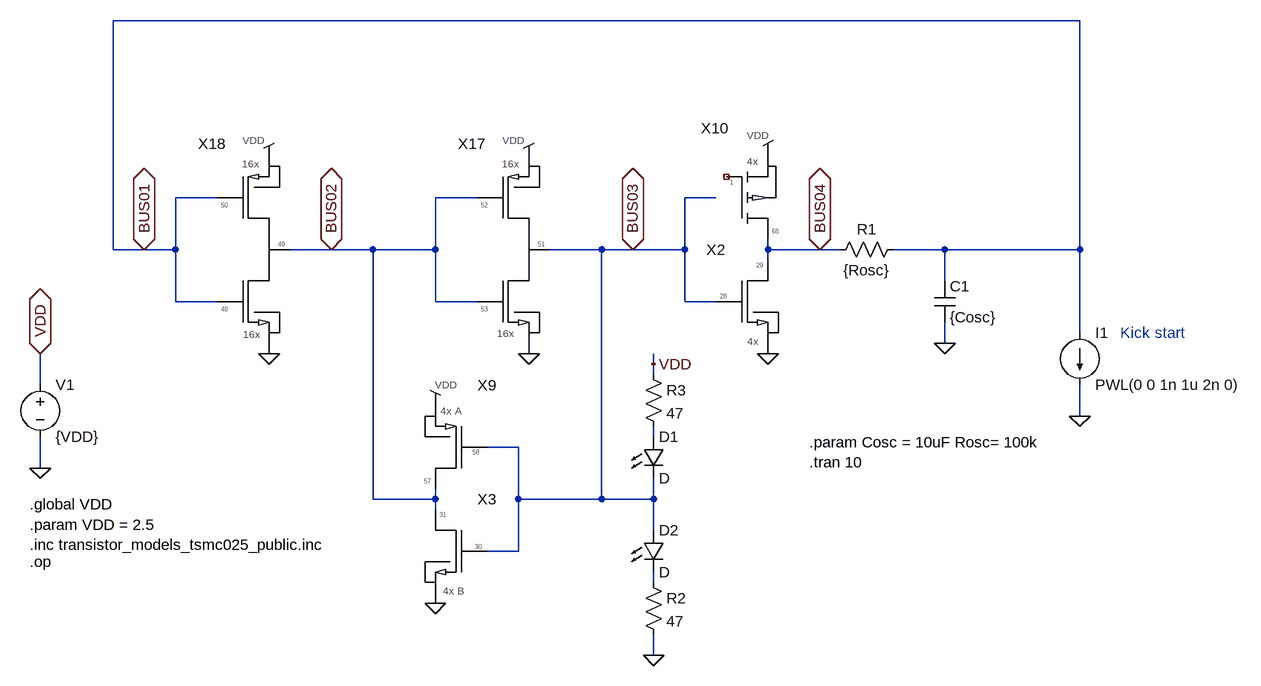
[diagram p0: schematic Example_Schmitt_Trigger_Relaxation_Oscillator.asc]
Example_Schmitt_Trigger_Relaxation_Oscillator.asc, the LTspice schematic file:
Version 4
SHEET 1 4424 996
WIRE 3664 -576 2176 -576
WIRE 2336 -304 2272 -304
WIRE 2736 -304 2672 -304
WIRE 3104 -304 3056 -304
WIRE 2176 -224 2176 -576
WIRE 2224 -224 2176 -224
WIRE 2272 -224 2272 -304
WIRE 2272 -224 2224 -224
WIRE 2512 -224 2448 -224
WIRE 2576 -224 2512 -224
WIRE 2672 -224 2672 -304
WIRE 2672 -224 2576 -224
WIRE 2928 -224 2848 -224
WIRE 2976 -224 2928 -224
WIRE 3056 -224 3056 -304
WIRE 3056 -224 2976 -224
WIRE 3184 -224 3184 -240
WIRE 3264 -224 3184 -224
WIRE 3296 -224 3264 -224
WIRE 3456 -224 3376 -224
WIRE 3664 -224 3664 -576
WIRE 3664 -224 3456 -224
WIRE 3184 -208 3184 -224
WIRE 3456 -176 3456 -224
WIRE 2272 -144 2272 -224
WIRE 2336 -144 2272 -144
WIRE 2672 -144 2672 -224
WIRE 2736 -144 2672 -144
WIRE 3056 -144 3056 -224
WIRE 3104 -144 3056 -144
WIRE 3664 -96 3664 -224
WIRE 3456 -80 3456 -112
WIRE 3008 -48 3008 -64
WIRE 3008 -32 3008 -48
WIRE 2064 -16 2064 -64
WIRE 3664 32 3664 -16
WIRE 3008 64 3008 48
WIRE 2800 80 2752 80
WIRE 2064 112 2064 64
WIRE 2576 160 2576 -224
WIRE 2672 160 2672 144
WIRE 2672 160 2576 160
WIRE 2800 160 2800 80
WIRE 2928 160 2928 -224
WIRE 2928 160 2800 160
WIRE 3008 160 3008 128
WIRE 3008 160 2928 160
WIRE 2672 176 2672 160
WIRE 3008 208 3008 160
WIRE 2800 240 2800 160
WIRE 2800 240 2752 240
WIRE 3008 288 3008 272
WIRE 3008 400 3008 368
FLAG 2224 -224 BUS01
IOPIN 2224 -224 BiDir
FLAG 2512 -224 BUS02
IOPIN 2512 -224 BiDir
FLAG 2976 -224 BUS03
IOPIN 2976 -224 BiDir
FLAG 3264 -224 BUS04
IOPIN 3264 -224 BiDir
FLAG 2064 -64 VDD
IOPIN 2064 -64 BiDir
FLAG 2064 112 0
FLAG 3664 32 0
FLAG 3456 -80 0
FLAG 3008 400 0
FLAG 3008 -48 VDD
SYMBOL CS_nMOS_4x_A 3136 -192 R0
SYMATTR InstName X2
SYMBOL voltage 2064 -32 R0
SYMATTR InstName V1
SYMATTR Value {VDD}
SYMBOL CS_pMOS_4x_A 2736 32 M0
SYMATTR InstName X9
SYMBOL CS_pMOS_4x_B 3120 -352 R0
SYMATTR InstName X10
SYMBOL CS_nMOS_4x_B 2720 192 M0
SYMATTR InstName X3
SYMBOL inverter_A 2752 -352 R0
WINDOW 0 -24 -19 Bottom 2
SYMATTR InstName X17
SYMBOL inverter_B 2352 -352 R0
WINDOW 0 -24 -19 Bottom 2
SYMATTR InstName X18
SYMBOL current 3664 -96 R0
SYMATTR InstName I1
SYMATTR Value PWL(0 0 1n 1u 2n 0)
SYMBOL Res 3392 -240 R90
WINDOW 0 0 56 VBottom 2
WINDOW 3 32 56 VTop 2
SYMATTR InstName R1
SYMATTR Value {Rosc}
SYMBOL Cap 3440 -176 R0
SYMATTR InstName C1
SYMATTR Value {Cosc}
SYMBOL Res 2992 -48 R0
SYMATTR InstName R3
SYMATTR Value 47
SYMBOL Res 2992 272 R0
SYMATTR InstName R2
SYMATTR Value 47
SYMBOL LED 2992 64 R0
SYMATTR InstName D1
SYMBOL LED 2992 208 R0
SYMATTR InstName D2
TEXT 2048 168 Left 2 !.global VDD\n.param VDD = 2.5\n.inc transistor_models_tsmc025_public.inc
TEXT 2048 256 Left 2 !.op
TEXT 3776 -96 Center 2 ;Kick start
TEXT 3248 72 Left 2 !.param Cosc = 10uF Rosc= 100k\n.tran 10

The netlist it stands for:
* Example_Schmitt_Trigger_Relaxation_Oscillator.asc
XX2 BUS03 BUS04 CS_nMOS_4x_A  ; pins gate drain
V1 VDD 0 {VDD}
XX9 BUS02 BUS03 CS_pMOS_4x_A  ; pins drain gate
XX10 BUS04 NC_01 CS_pMOS_4x_B  ; pins drain gate
XX3 BUS03 BUS02 CS_nMOS_4x_B  ; pins gate drain
XX17 BUS02 BUS02 BUS03 inverter_A  ; pins inn inp out
XX18 BUS01 BUS01 BUS02 inverter_B  ; pins inn inp out
I1 BUS01 0 PWL(0 0 1n 1u 2n 0)
R1 BUS01 BUS04 {Rosc}
C1 BUS01 0 {Cosc}
R3 VDD N001 47
R2 N002 0 47
D1 N001 BUS03 D
D2 BUS03 N002 D
.model D D
.lib standard.dio
.global VDD
.param VDD = 2.5
.inc transistor_models_tsmc025_public.inc
.op
* Kick start
.param Cosc = 10uF Rosc= 100k
.tran 10
.backanno
.end